# Altium schematic sheet INFRARED.SchDoc
size A4
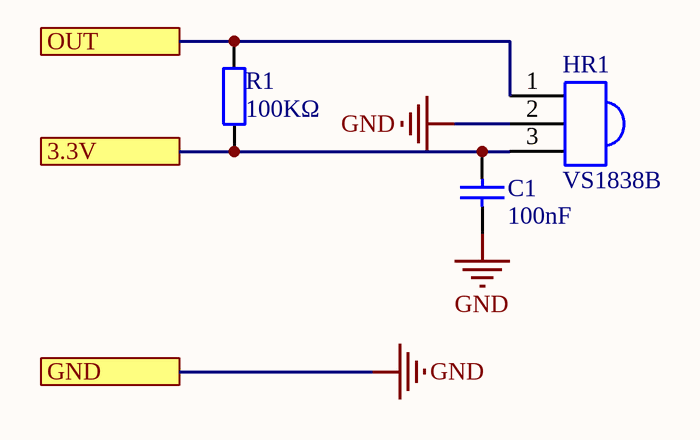
[diagram p0: INFRARED.SchDoc]

## Parts
C1  100nF  [LC-0603_C]
HR1  VS1838B  [VS1838B-A]
R1  100KΩ  [LC-0603_R]

## Ports
3.3V, GND, OUT

## Nets
GND: C1.1 HR1.2(K) ; port GND
3.3V: C1.2 HR1.3(E) R1.2 ; port 3.3V
OUT: HR1.1(A) R1.1 ; port OUT

## Library data of the parts
C1 = 0603 100nF (104) 10% 50V: 贴片电容; ComponentLink1Description: 供应商链接; ComponentLink1URL: http://www.szlcsc.com/product/details_15331.html; Package: 0603; Supplier: LC; SuppliersPartNumber: C14663
HR1 = VS1838B: 红外接收头; 版权归属: 封装库来自淘宝 ID：黄晶宝石; BOM名称: 红外接收头; 技术支持，联系售后: https://shop463601444.taobao.com
R1 = 0603 100KΩ (1003) 1%: 贴片电阻; ComponentLink1Description: 供应商链接; ComponentLink1URL: http://www.szlcsc.com/product/details_26546.html; Package: 0603; Supplier: LC; SuppliersPartNumber: C25803